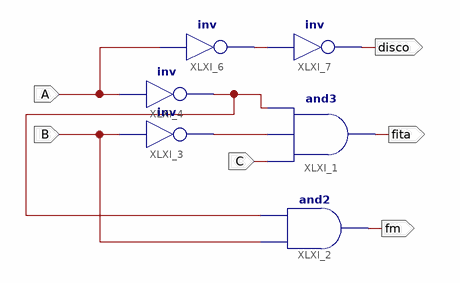
[diagram p0: schematic sheet 1]
// Xilinx ISE schematic ex05.sch (artix7) as structural Verilog: 6 symbols, 6 ports
module ex05 (
  input  A,
  input  B,
  input  C,
  output fita,
  output fm,
  output disco
);

  wire XLXN_1, XLXN_2, XLXN_11;

  and XLXI_1 (fita, C, XLXN_2, XLXN_1);
  and XLXI_2 (fm, B, XLXN_1);
  not XLXI_3 (XLXN_2, B);
  not XLXI_4 (XLXN_1, A);
  not XLXI_6 (XLXN_11, A);
  not XLXI_7 (disco, XLXN_11);
endmodule
